# Altium schematic sheet connerctor_3-5v.SchDoc: myA4
size A4; Date: 2018/03/30; DrawnBy: 亓岳鑫; Organization: Altium Limited; Address1: 3 Minna Close; Address2: Belrose; Address3: NSW 2085; Address4: Australia; DocumentNumber: 6; Revision: Alfa 2.0; SheetNumber: 6; SheetTotal: 6; Time: 17:30
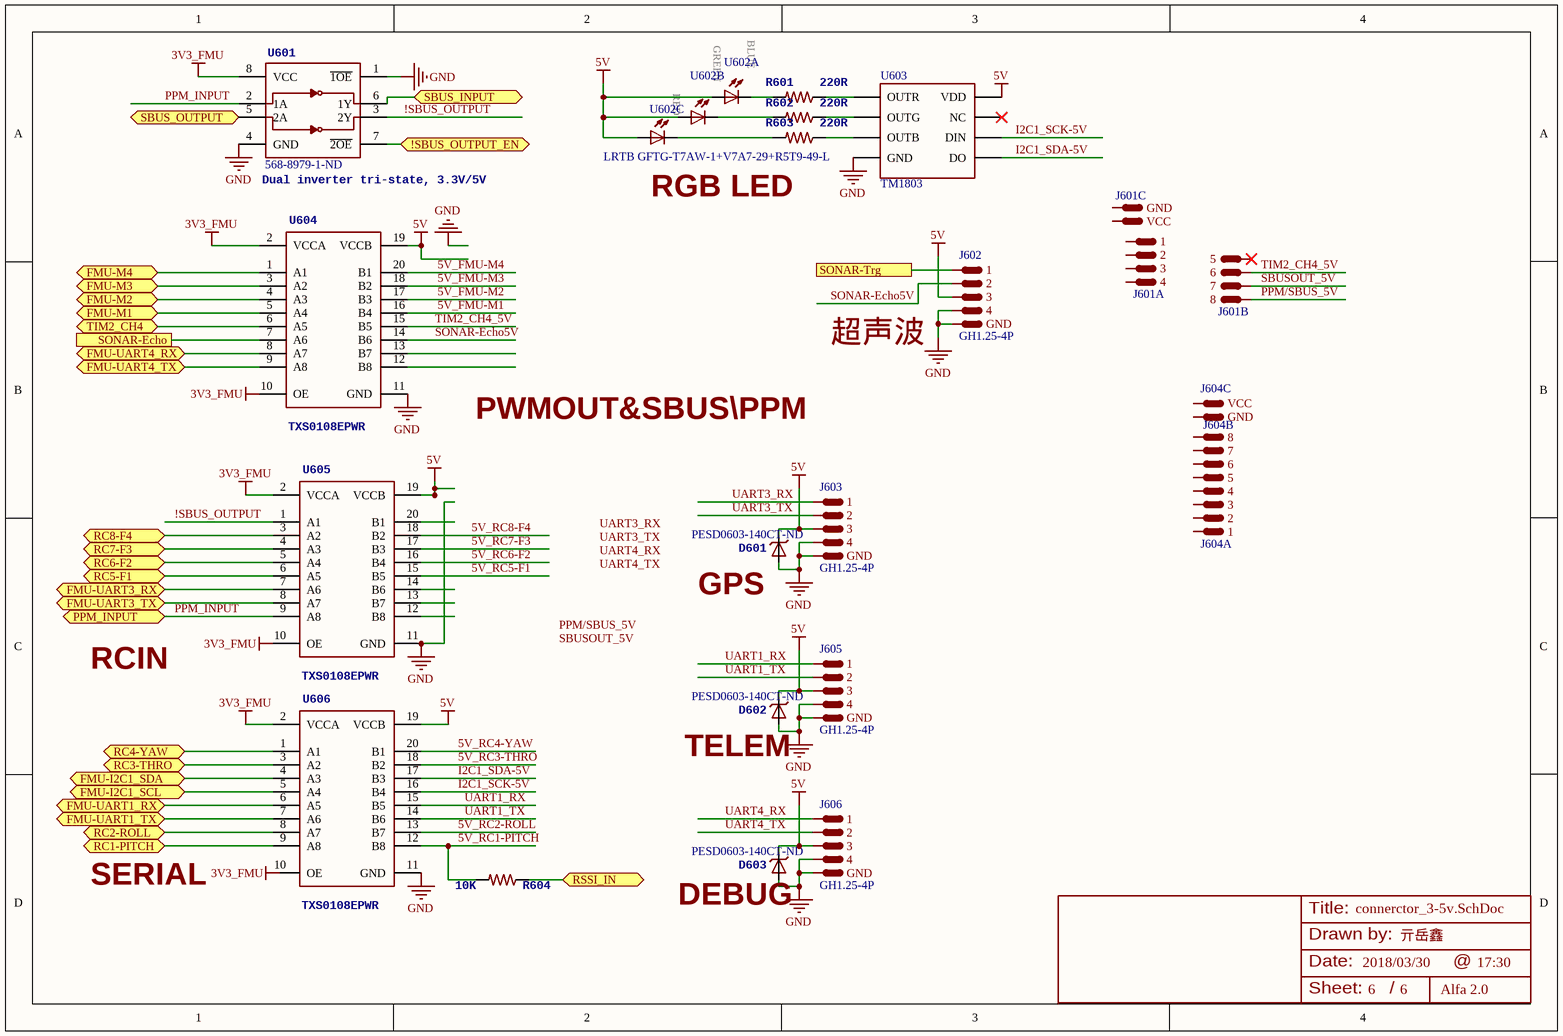
[diagram p0: connerctor_3-5v.SchDoc]

## Parts
D601  Supplier Part Number 1: PESD0603-140CT-ND  [0603-ESD]  (hidden comment: PESD0603-140)
D602  Supplier Part Number 1: PESD0603-140CT-ND  [0603-ESD]  (hidden comment: PESD0603-140)
D603  Supplier Part Number 1: PESD0603-140CT-ND  [0603-ESD]  (hidden comment: PESD0603-140)
J601  JR 3X8  [JR3X8]  (value not drawn)  (parts A,B,C of 3)
J602  GH1.25-4P  [1.25-4P]
J603  GH1.25-4P  [1.25-4P]
J604  JR 3X8  [JR3X8]  (value not drawn)  (parts A,B,C of 3)
J605  GH1.25-4P  [1.25-4P]
J606  GH1.25-4P  [1.25-4P]
R601  220R  [0603-RES]
R602  220R  [0603-RES]
R603  220R  [0603-RES]
R604  10K  [0603-RES]
U601  Dual inverter tri-state, 3.3V/5V  Supplier Part Number 1: 568-8979-1-ND  [TSSOP8_SOT505-2]
U602  LRTB GFTG-T7AW-1+V7A7-29+R5T9-49-L  [P-LCC-6]  (parts A,B,C of 3)
U603  TM1803  [SO08]
U604  TXS0108EPWR  [SOP65P640-20N]
U605  TXS0108EPWR  [SOP65P640-20N]
U606  TXS0108EPWR  [SOP65P640-20N]

## Ports
!SBUS_OUTPUT_EN, FMU-I2C1_SCL, FMU-I2C1_SDA, FMU-M1, FMU-M2, FMU-M3, FMU-M4, FMU-UART1_RX, FMU-UART1_TX, FMU-UART3_RX, FMU-UART3_TX, FMU-UART4_RX, FMU-UART4_TX, PPM_INPUT, RC1-PITCH, RC2-ROLL, RC3-THRO, RC4-YAW, RC5-F1, RC6-F2, RC7-F3, RC8-F4, RSSI_IN, SBUS_INPUT, SBUS_OUTPUT, SONAR-Echo, SONAR-Trg, TIM2_CH4

## Nets
3V3_FMU: U601.8(VCC) U604.2(VCCA) U604.10(OE) U605.2(VCCA) U605.10(OE) U606.2(VCCA)
5V: D601.C D602.C D603.C J602.3 J603.3 J605.3 J606.3 U602.A1(A) U602.A2(A) U602.A3(A) U603.8(VDD) U604.19(VCCB) U605.19(VCCB) U606.19(VCCB)
GND: D601.A D602.A D603.A J602.4 J602.GND J603.4 J603.GND J605.4 J605.GND J606.4 J606.GND U601.1(~{1OE}) U601.4(GND) U603.4(GND) U604.11(GND) U605.11(GND) U606.11(GND)
5V_FMU-M1: U604.16(B4)
5V_FMU-M2: U604.17(B3)
5V_FMU-M3: U604.18(B2)
5V_FMU-M4: U604.20(B1)
5V_RC1-PITCH: R604.2 U606.12(B8)
5V_RC2-ROLL: U606.13(B7)
5V_RC3-THRO: U606.18(B2)
5V_RC4-YAW: U606.20(B1)
5V_RC5-F1: U605.15(B5)
5V_RC6-F2: U605.16(B4)
5V_RC7-F3: U605.17(B3)
5V_RC8-F4: U605.18(B2)
!SBUS_OUTPUT: U601.3(2Y) U605.1(A1)
!SBUS_OUTPUT_EN: U601.7(~{2OE}) ; port !SBUS_OUTPUT_EN
FMU-I2C1_SCL: U606.5(A4) ; port FMU-I2C1_SCL
FMU-I2C1_SDA: U606.4(A3) ; port FMU-I2C1_SDA
FMU-M1: U604.5(A4) ; port FMU-M1
FMU-M2: U604.4(A3) ; port FMU-M2
FMU-M3: U604.3(A2) ; port FMU-M3
FMU-M4: U604.1(A1) ; port FMU-M4
FMU-UART1_RX: U606.6(A5) ; port FMU-UART1_RX
FMU-UART1_TX: U606.7(A6) ; port FMU-UART1_TX
FMU-UART3_RX: U605.7(A6) ; port FMU-UART3_RX
FMU-UART3_TX: U605.8(A7) ; port FMU-UART3_TX
FMU-UART4_RX: U604.8(A7) ; port FMU-UART4_RX
FMU-UART4_TX: U604.9(A8) ; port FMU-UART4_TX
I2C1_SCK-5V: U603.6(DIN) U606.16(B4)
I2C1_SDA-5V: U603.5(DO) U606.17(B3)
PPM/SBUS_5V: J601.8
PPM_INPUT: U601.2(1A) U605.9(A8) ; port PPM_INPUT
RC1-PITCH: U606.9(A8) ; port RC1-PITCH
RC2-ROLL: U606.8(A7) ; port RC2-ROLL
RC3-THRO: U606.3(A2) ; port RC3-THRO
RC4-YAW: U606.1(A1) ; port RC4-YAW
RC5-F1: U605.6(A5) ; port RC5-F1
RC6-F2: U605.5(A4) ; port RC6-F2
RC7-F3: U605.4(A3) ; port RC7-F3
RC8-F4: U605.3(A2) ; port RC8-F4
RSSI_IN: R604.1 ; port RSSI_IN
SBUS_INPUT: U601.6(1Y) ; port SBUS_INPUT
SBUS_OUTPUT: U601.5(2A) ; port SBUS_OUTPUT
SBUSOUT_5V: J601.7
SONAR-Echo: U604.7(A6) ; port SONAR-Echo
SONAR-Echo5V: J602.2 U604.14(B6)
SONAR-Trg: J602.1 ; port SONAR-Trg
TIM2_CH4: U604.6(A5) ; port TIM2_CH4
TIM2_CH4_5V: J601.6 U604.15(B5)
UART1_RX: J605.1 U606.15(B5)
UART1_TX: J605.2 U606.14(B6)
UART3_RX: J603.1
UART3_TX: J603.2
UART4_RX: J606.1
UART4_TX: J606.2
NetR601_1: R601.1 U603.1(OUTR)
NetR601_2: R601.2 U602.C1(C)
NetR602_1: R602.1 U603.2(OUTG)
NetR602_2: R602.2 U602.C2(C)
NetR603_1: R603.1 U603.3(OUTB)
NetR603_2: R603.2 U602.C3(C)

Not connected (* = marked no-connect by the designer): J601 1 2 3 4 5* GND VCC; J604 1 2 3 4 5 6 7 8 GND VCC; U603 7(NC)*; U604 12(B8) 13(B7); U605 12(B8) 13(B7) 14(B6) 20(B1); U606 10(OE)

## Notes on the sheet
- RGB LED
- 超声波
- PWMOUT&SBUS\PPM
- (near D601) GPS
- RCIN
- (near D602) TELEM
- SERIAL
- (near D603) DEBUG
- Labels drawn without touching a wire or pin: 3V3_FMU, PPM/SBUS_5V, SBUSOUT_5V, UART3_RX, UART3_TX, UART4_RX, UART4_TX
- Title:
- Drawn by:
- Date:
- @
- Sheet:
- /
- (in symbol LED-RGB, part A) BLUE
- (in symbol LED-RGB, part B) GREEN
- (in symbol LED-RGB, part C) RED

## Library data of the parts
D601-D603 = DIODE-ESD: TVS DIODE 14V 0603; Supplier 1: Digi-Key
J601 J604 = JR 3X8: Header 3X8 pins
J602 J603 J605 J606 = GH1.25-4P: GH1.25mm 立贴 间距1.25mm 连接器贴片
R601-R603 = RES0603-220R: RES 220R OHM 1/10W 5% 0603; Value: 220R; Supplier 1: Digi-Key; Supplier Part Number 1: 311-220GRCT-ND
R604 = RES0603-10K: RES 10K OHM 1/10W 5% 0603; Value: 10K; Supplier 1: Digi-Key; Supplier Part Number 1: A126331TR-ND
U601 = 74LVC2G240-TSSOP-8: IC INVERTER DUAL 4-INPUT 8TSSOP; 3DR_PARTNO: ECM0817; PARTNO: 74LVC2G240DP,125; Value: INV; Supplier 1: Digi-Key
U602 = LED-RGB: Muti LEDs
U603 = LED_DRV-TM1803: 3-Channel Constant-Current LED Driver
U604-U606 = TXS0108EPWR: IC XLATR VOLT-LVL 8B BDIR 20SOP; Supplier 1: Digi-Key; Supplier Part Number 1: 296-23011-1-ND